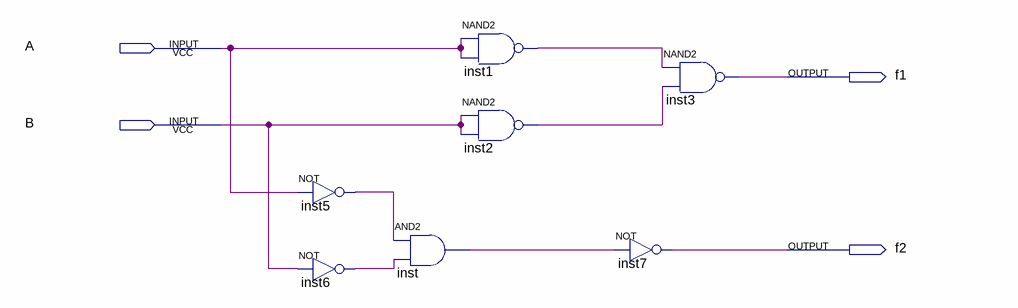
[diagram p0: schematic sheet]
// Quartus schematic 1.2.bdf as structural Verilog: 7 symbols, 4 pins
module \1.2  (
  input  A,
  input  B,
  output f1,
  output f2
);

  wire inst1_out, inst2_out, inst5_out, inst6_out, inst_out;

  not inst5 (inst5_out, A);
  not inst6 (inst6_out, B);
  and inst (inst_out, inst5_out, inst6_out);
  nand inst1 (inst1_out, A, A);
  nand inst2 (inst2_out, B, B);
  not inst7 (f2, inst_out);
  nand inst3 (f1, inst1_out, inst2_out);
endmodule
